# Altium schematic sheet mcu.SchDoc: {Наименование}
size 209 x 297 mm; DocumentNumber: {Обозначение}; SheetNumber: 2; SheetTotal: 4; PageSetup: Record=PageOptions|CenterHorizontal=False|CenterVertical=False|PrintScale=0.95|XCorrection=0.00|YCorrection=0.00|PrintKind=1|BorderSize=5000000|LeftOffset=0|BottomOffset=0|Orientation=1|PaperLength=1000|PaperWidth=1000|Scale=100|PaperSource=15|PrintQuality=600|MediaType=1|DitherType=10|PaperKind=A4|PrintScaleMode=1; Rule: PcbType=ProtelPcb
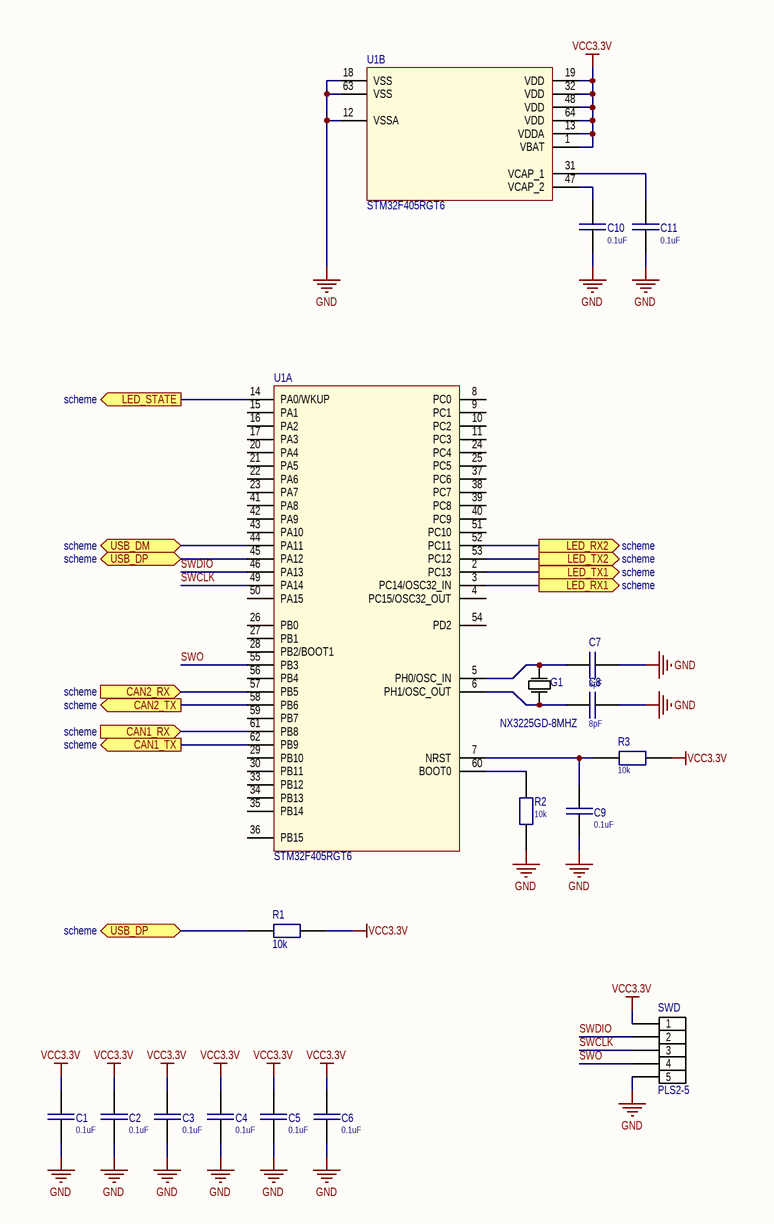
[diagram p0: mcu.SchDoc]

## Parts
C1  0.1uF  [C_0603]
C2  0.1uF  [C_0603]
C3  0.1uF  [C_0603]
C4  0.1uF  [C_0603]
C5  0.1uF  [C_0603]
C6  0.1uF  [C_0603]
C7  8pF  [C_0603]
C8  8pF  [C_0603]
C9  0.1uF  [C_0603]
C10  0.1uF  [C_0603]
C11  0.1uF  [C_0603]
G1  NX3225GD-8MHZ  [NX3225GD]
R1  10k  [R_0603]
R2  10k  [R_0603]
R3  10k  [R_0603]
SWD  PLS2-5  [PLS-5-3D]  (net tie, no BOM)
U1  STM32F405RGT6  [LQFP64-10x10mm]  (parts A,B of 2)

## Ports
CAN1_RX (in, see scheme), CAN1_TX (out, see scheme), CAN2_RX (in, see scheme), CAN2_TX (out, see scheme), LED_RX1 (out, see scheme), LED_RX2 (out, see scheme), LED_STATE (out, see scheme), LED_TX1 (out, see scheme), LED_TX2 (out, see scheme), USB_DM (bidir, see scheme), USB_DP (bidir, see scheme)

## Nets
GND: C1.1 C2.1 C3.1 C4.1 C5.1 C6.1 C7.1 C8.1 C9.1 C10.1 C11.1 R2.1 SWD.5 U1.12(VSSA) U1.18(VSS) U1.63(VSS)
VCC3.3V: C1.2 C2.2 C3.2 C4.2 C5.2 C6.2 R1.1 R3.2 SWD.1 U1.1(VBAT) U1.13(VDDA) U1.19(VDD) U1.32(VDD) U1.48(VDD) U1.64(VDD)
CAN1_RX: U1.61(PB8) ; port CAN1_RX
CAN1_TX: U1.62(PB9) ; port CAN1_TX
CAN2_RX: U1.57(PB5) ; port CAN2_RX
CAN2_TX: U1.58(PB6) ; port CAN2_TX
LED_RX1: U1.3(PC14/OSC32_IN) ; port LED_RX1
LED_RX2: U1.52(PC11) ; port LED_RX2
LED_STATE: U1.14(PA0/WKUP) ; port LED_STATE
LED_TX1: U1.2(PC13) ; port LED_TX1
LED_TX2: U1.53(PC12) ; port LED_TX2
SWCLK: SWD.3 U1.49(PA14)
SWDIO: SWD.2 U1.46(PA13)
SWO: SWD.4 U1.55(PB3)
USB_DM: U1.44(PA11) ; port USB_DM
USB_DP: R1.2 U1.45(PA12) ; port USB_DP
NetC7_2: C7.2 G1.2(OSC2) U1.5(PH0/OSC_IN)
NetC8_2: C8.2 G1.1(OSC1) U1.6(PH1/OSC_OUT)
NetC9_2: C9.2 R3.1 U1.7(NRST)
NetC10_2: C10.2 U1.47(VCAP_2)
NetC11_2: C11.2 U1.31(VCAP_1)
NetR2_2: R2.2 U1.60(BOOT0)

Not connected (* = marked no-connect by the designer): U1 4(PC15/OSC32_OUT) 8(PC0) 9(PC1) 10(PC2) 11(PC3) 15(PA1) 16(PA2) 17(PA3) 20(PA4) 21(PA5) 22(PA6) 23(PA7) 24(PC4) 25(PC5) 26(PB0) 27(PB1) 28(PB2/BOOT1) 29(PB10) 30(PB11) 33(PB12) 34(PB13) 35(PB14) 36(PB15) 37(PC6) 38(PC7) 39(PC8) 40(PC9) 41(PA8) 42(PA9) 43(PA10) 50(PA15) 51(PC10) 54(PD2) 56(PB4) 59(PB7)

## Notes on the sheet
- Подп. и дата
- Инв. № дубл.
- Взам. инв. №
- Инв. № подл.
- Лист
- Изм.
- № докум.
- Подп.
- Дата

## Library data of the parts
C1-C6 C9-C11 = CAP_SMD: Capacitor; Part Number: CC0603KPX7R9BB104; Alternative Part: *; Value: 0.1uF
C7 C8 = CAP_SMD: Capacitor; Part Number: CC0603DRNPO9BN8R0; Alternative Part: *; Value: 8pF
G1 = NX3225GD: Crystal Oscillator; Part Number: NX3225GD-8MHZ-EXS00A-CG05041; Alternative Part: *
R1-R3 = RES_SMD: Resistor; Part Number: RC0603FR-0710KL; Alternative Part: *; Value: 10k
SWD = PLS2-5: Header, 5-Pin; Part Number: PLS-5; LatestRevisionDate: 17-Jul-2002; LatestRevisionNote: Re-released for DXP Platform.; Publisher: Altium Limited
U1 = STM32F405RGT6: No Description Available; Mfr_Name: STMicroelectronics; Copyright: Copyright (C) 2022 Ultra Librarian. All rights reserved.; Manufacturer_Part_Number: STM32F405RGT6; RefDes: RefDes; Type: DEV; Part Number: STM32F405RGT6